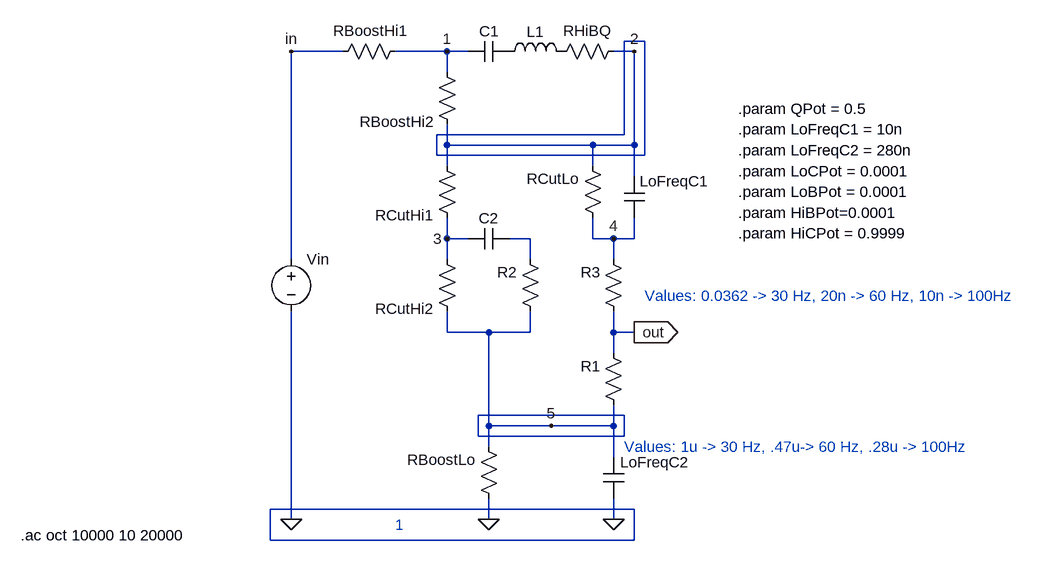
[diagram p0: schematic EQP1_gyraf_test.asc]
EQP1_gyraf_test.asc, the LTspice schematic file:
Version 4
SHEET 1 1112 1412
WIRE -160 -208 -192 -208
WIRE -624 -192 -704 -192
WIRE -464 -192 -544 -192
WIRE -432 -192 -464 -192
WIRE -176 -192 -208 -192
WIRE -464 -160 -464 -192
WIRE -192 -64 -192 -208
WIRE -192 -64 -480 -64
WIRE -464 -48 -464 -80
WIRE -240 -48 -464 -48
WIRE -176 -48 -176 -192
WIRE -176 -48 -240 -48
WIRE -480 -32 -480 -64
WIRE -160 -32 -160 -208
WIRE -160 -32 -480 -32
WIRE -464 -16 -464 -48
WIRE -240 -16 -240 -48
WIRE -176 0 -176 -48
WIRE -464 96 -464 64
WIRE -432 96 -464 96
WIRE -336 96 -368 96
WIRE -240 96 -240 64
WIRE -208 96 -240 96
WIRE -176 96 -176 64
WIRE -176 96 -208 96
WIRE -704 128 -704 -192
WIRE -464 128 -464 96
WIRE -336 128 -336 96
WIRE -208 128 -208 96
WIRE -464 240 -464 208
WIRE -400 240 -464 240
WIRE -336 240 -336 208
WIRE -336 240 -400 240
WIRE -208 240 -208 208
WIRE -176 240 -208 240
WIRE -208 272 -208 240
WIRE -192 368 -416 368
WIRE -400 384 -400 240
WIRE -304 384 -400 384
WIRE -208 384 -208 352
WIRE -208 384 -304 384
WIRE -416 400 -416 368
WIRE -192 400 -192 368
WIRE -192 400 -416 400
WIRE -400 416 -400 384
WIRE -208 432 -208 384
WIRE -176 512 -736 512
WIRE -704 528 -704 208
WIRE -400 528 -400 496
WIRE -208 528 -208 496
WIRE -736 560 -736 512
WIRE -176 560 -176 512
WIRE -176 560 -736 560
FLAG -704 528 0
FLAG -400 528 0
FLAG -208 528 0
FLAG -176 240 out
IOPIN -176 240 Out
FLAG -704 -192 in
FLAG -464 -192 1
FLAG -176 -192 2
FLAG -464 96 3
FLAG -208 96 4
FLAG -304 384 5
SYMBOL cap -432 -176 R270
WINDOW 0 47 17 VRight 2
WINDOW 3 0 32 Invisible 2
SYMATTR InstName C1
SYMATTR Value 10n
SYMBOL ind -384 -176 R270
WINDOW 0 46 42 VRight 2
WINDOW 3 1 57 Invisible 2
SYMATTR InstName L1
SYMATTR Value 100m
SYMBOL cap -192 0 R0
WINDOW 3 24 56 Invisible 2
SYMATTR Value {LoFreqC1}
SYMATTR InstName LoFreqC1
SYMBOL voltage -704 112 R0
WINDOW 3 24 96 Invisible 2
SYMATTR Value ""
SYMATTR Value2 AC 1
SYMATTR InstName Vin
SYMBOL res -528 -208 R90
WINDOW 0 0 54 VBottom 2
WINDOW 3 -10 54 Invisible 2
SYMATTR InstName RBoostHi1
SYMATTR Value {(1-HiBPot)*10k}
SYMBOL res -448 -64 R180
WINDOW 0 36 20 Left 2
WINDOW 3 36 48 Invisible 2
SYMATTR InstName RBoostHi2
SYMATTR Value {HiBPot*10k}
SYMBOL res -192 -208 R90
WINDOW 0 0 56 VBottom 2
WINDOW 3 32 56 Invisible 2
SYMATTR InstName RHiBQ
SYMATTR Value {QPot*2k5}
SYMBOL res -224 80 R180
WINDOW 0 36 76 Left 2
WINDOW 3 36 40 Invisible 2
SYMATTR InstName RCutLo
SYMATTR Value {LoCPot*100k}
SYMBOL res -448 80 R180
WINDOW 0 36 20 Left 2
WINDOW 3 36 48 Invisible 2
SYMATTR InstName RCutHi1
SYMATTR Value {(1-HiCPot)*1k}
SYMBOL cap -368 80 R90
WINDOW 0 0 32 VBottom 2
WINDOW 3 32 32 Invisible 2
SYMATTR InstName C2
SYMATTR Value 197n
SYMBOL res -320 224 R180
WINDOW 0 36 76 Left 2
WINDOW 3 36 40 Invisible 2
SYMATTR InstName R2
SYMATTR Value 75
SYMBOL res -448 224 R180
WINDOW 0 36 20 Left 2
WINDOW 3 36 48 Invisible 2
SYMATTR InstName RCutHi2
SYMATTR Value {HiCPot*1k}
SYMBOL res -192 224 R180
WINDOW 0 36 76 Left 2
WINDOW 3 36 40 Invisible 2
SYMATTR InstName R3
SYMATTR Value 0.001
SYMBOL res -384 512 R180
WINDOW 0 36 76 Left 2
WINDOW 3 36 40 Invisible 2
SYMATTR InstName RBoostLo
SYMATTR Value {LoBPot*10k}
SYMBOL cap -224 432 R0
WINDOW 0 26 8 Left 2
WINDOW 3 24 56 Invisible 2
SYMATTR InstName LoFreqC2
SYMATTR Value {LoFreqC2}
SYMBOL res -192 368 R180
WINDOW 0 36 76 Left 2
WINDOW 3 36 40 Invisible 2
SYMATTR InstName R1
SYMATTR Value 10k
TEXT -160 184 Left 2 ;Values: 0.0362 -> 30 Hz, 20n -> 60 Hz, 10n -> 100Hz
TEXT -192 416 Left 2 ;Values: 1u -> 30 Hz, .47u-> 60 Hz, .28u -> 100Hz
TEXT -544 536 Left 2 ;1
TEXT -16 -72 Left 2 !.param LoFreqC1 = 10n
TEXT -16 -104 Left 2 !.param QPot = 0.5
TEXT -16 -40 Left 2 !.param LoFreqC2 = 280n
TEXT -16 -8 Left 2 !.param LoCPot = 0.0001
TEXT -16 56 Left 2 !.param HiBPot=0.0001
TEXT -16 88 Left 2 !.param HiCPot = 0.9999
TEXT -1120 552 Left 2 !.ac oct 10000 10 20000
TEXT -16 24 Left 2 !.param LoBPot = 0.0001

The netlist it stands for:
* EQP1_gyraf_test.asc
C1 1 P001 10n
L1 P001 P002 100m
C§LoFreqC1 2 4 {LoFreqC1}
Vin in 0 AC 1
RBoostHi1 1 in {(1-HiBPot)*10k}
RBoostHi2 2 1 {HiBPot*10k}
RHiBQ 2 P002 {QPot*2k5}
RCutLo 4 2 {LoCPot*100k}
RCutHi1 3 2 {(1-HiCPot)*1k}
C2 N002 3 197n
R2 5 N002 75
RCutHi2 5 3 {HiCPot*1k}
R3 out 4 0.001
RBoostLo 0 5 {LoBPot*10k}
C§LoFreqC2 5 0 {LoFreqC2}
R1 5 out 10k
* Values: 0.0362 -> 30 Hz, 20n -> 60 Hz, 10n -> 100Hz
* Values: 1u -> 30 Hz, .47u-> 60 Hz, .28u -> 100Hz
* 1
.param LoFreqC1 = 10n
.param QPot = 0.5
.param LoFreqC2 = 280n
.param LoCPot = 0.0001
.param HiBPot=0.0001
.param HiCPot = 0.9999
.ac oct 10000 10 20000
.param LoBPot = 0.0001
.backanno
.end